# EAGLE design mcu_brd3 (EAGLE 7.7.0)
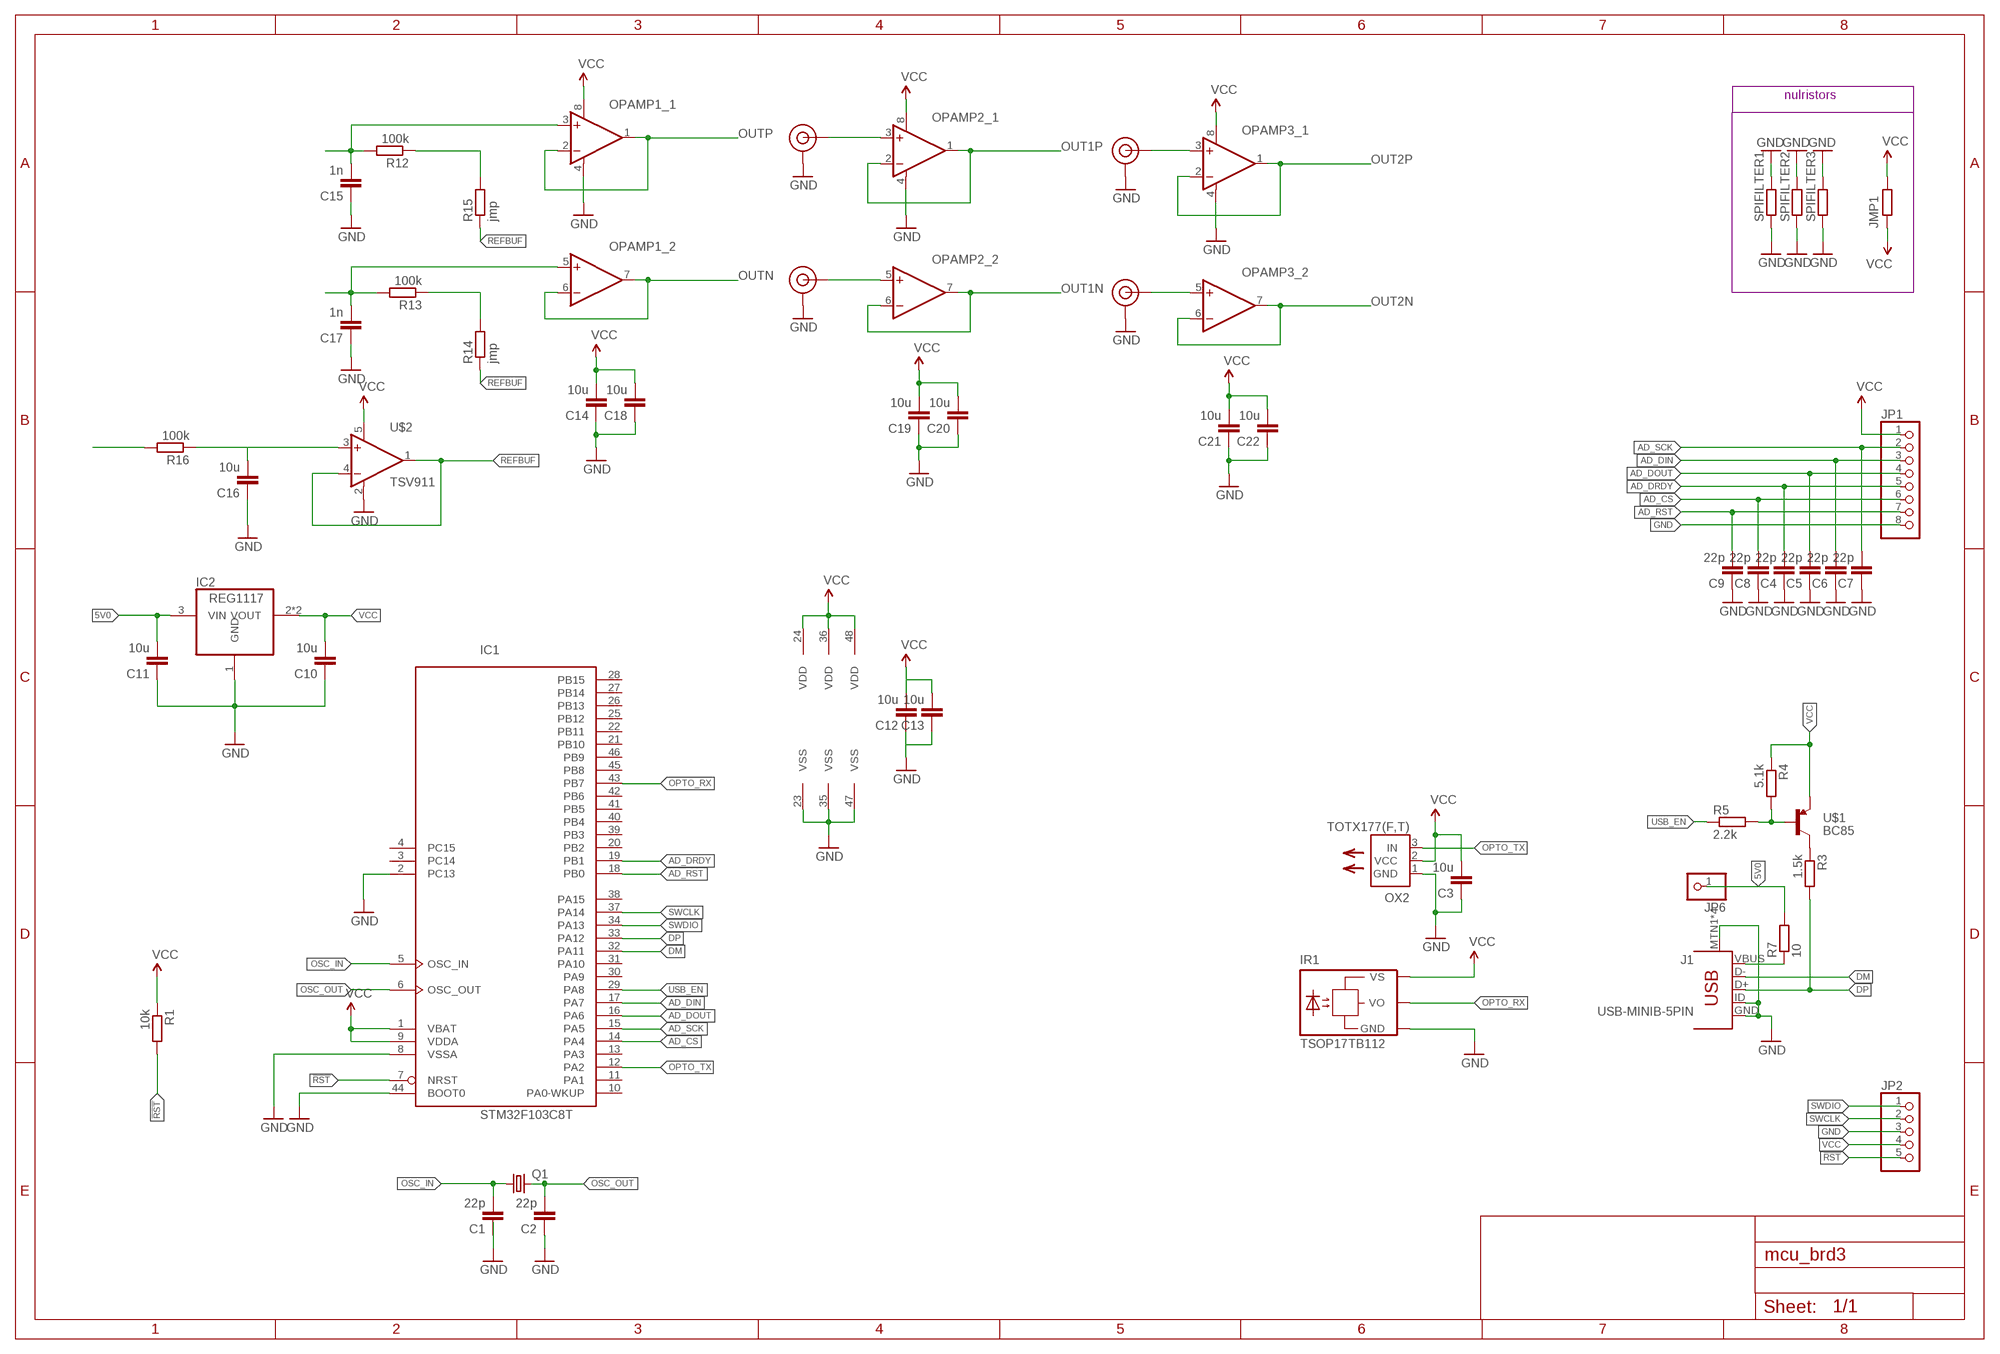
[diagram p0: schematic, sheet 1]

## Parts
C1  22p  CC0603  [C0603]
C2  22p  CC0603  [C0603]
C3  10u  CC0603  [C0603]
C4  22p  CC0603  [C0603]
C5  22p  CC0603  [C0603]
C6  22p  CC0603  [C0603]
C7  22p  CC0603  [C0603]
C8  22p  CC0603  [C0603]
C9  22p  CC0603  [C0603]
C10  10u  CC0805  [C0805]
C11  10u  CC0805  [C0805]
C12  10u  CC0805  [C0805]
C13  10u  CC0805  [C0805]
C14  10u  CC0805  [C0805]
C15  1n  CC0603  [C0603]
C16  10u  CC0805  [C0805]
C17  1n  CC0603  [C0603]
C18  10u  CC0805  [C0805]
C19  10u  CC0805  [C0805]
C20  10u  CC0805  [C0805]
C21  10u  CC0805  [C0805]
C22  10u  CC0805  [C0805]
IC1  STM32F103C8T  [LQFP48]
IC2  REG1117  [SOT223]
IR1  TSOP17TB112  [1X03]
J1  USB-MINIB-5PIN  [USB-MINIB]
J$1  SMA_EDGE  [SMA-EDGE]
J$2  SMA_EDGE  [SMA-EDGE]
J$3  SMA_EDGE  [SMA-EDGE]
J$4  SMA_EDGE  [SMA-EDGE]
JMP1  R0603  [0603]
JP1  PINHD-1X8  [1X08]
JP2  PINHD-1X5  [1X05]
JP6  PINHD-1X1  [1X01]
OPAMP1  LMC662  [SO08]
OPAMP2  LMC662  [SO08]
OPAMP3  LMC662  [SO08]
OX2  TOTX177(F,T)  [TOTX]
Q1  CRYSTALHC49UP  [HC49UP]
R1  10k  R0603  [0603]
R3  1.5k  R0603  [0603]
R4  5.1k  R0603  [0603]
R5  2.2k  R0603  [0603]
R7  10  R0805  [R0805]
R12  100k  R0603  [0603]
R13  100k  R0603  [0603]
R14  jmp  R0603  [0603]
R15  jmp  R0603  [0603]
R16  100k  R0603  [0603]
SPIFILTER1  R0603  [0603]
SPIFILTER2  R0603  [0603]
SPIFILTER3  R0603  [0603]
U$1  BC85  [SOT23]
U$2  TSV911  [SOT23-5L]

## Nets
5V0: C11.2 IC2.3(VIN) JP6.1 R7.2
!RST: IC1.7(NRST) JP2.5 R1.2
AD_CS: C8.2 IC1.14(PA4) JP1.6
AD_DIN: C6.2 IC1.17(PA7) JP1.3
AD_DOUT: C5.2 IC1.16(PA6) JP1.4
AD_DRDY: C4.2 IC1.19(PB1) JP1.5
AD_RST: C9.2 IC1.18(PB0) JP1.7
AD_SCK: C7.2 IC1.15(PA5) JP1.2
DM: IC1.32(PA11) J1.D-
DP: IC1.33(PA12) J1.D+ R3.2
GND: C1.1 C2.1 C3.1 C4.1 C5.1 C6.1 C7.1 C8.1 C9.1 C10.1 C11.1 C12.1 C13.1 C14.1 C15.1 C16.1 C17.1 C18.1 C19.1 C20.1 C21.1 C22.1 IC1.2(PC13) IC1.8(VSSA) IC1.23(VSS) IC1.35(VSS) IC1.44(BOOT0) IC1.47(VSS) IC2.1(GND) IR1.3(GND) J1.GND J1.ID J1.MTN1 J1.MTN2(MTN1) J1.MTN3(MTN1) J1.MTN4(MTN1) J$1.GND@0(GND) J$1.GND@1(GND) J$1.GND@2(GND) J$1.GND@3(GND) J$2.GND@0(GND) J$2.GND@1(GND) J$2.GND@2(GND) J$2.GND@3(GND) J$3.GND@0(GND) J$3.GND@1(GND) J$3.GND@2(GND) J$3.GND@3(GND) J$4.GND@0(GND) J$4.GND@1(GND) J$4.GND@2(GND) J$4.GND@3(GND) JP1.8 JP2.3 OPAMP1.4(_1:V-) OPAMP2.4(_1:V-) OPAMP3.4(_1:V-) OX2.1(GND) SPIFILTER1.1 SPIFILTER1.2 SPIFILTER2.1 SPIFILTER2.2 SPIFILTER3.1 SPIFILTER3.2 U$2.2(V-)
N$1: J$2.SIG(SIGNAL) OPAMP2.5(_2:+IN)
N$2: J$1.SIG(SIGNAL) OPAMP2.3(_1:+IN)
N$3: R3.1 U$1.3(C)
N$4: R4.2 R5.2 U$1.1(B)
N$5: J$4.SIG(SIGNAL) OPAMP3.5(_2:+IN)
N$6: C17.2 OPAMP1.5(_2:+IN) R13.2
N$7: J$3.SIG(SIGNAL) OPAMP3.3(_1:+IN)
N$8: R12.1 R15.2
N$10: C15.2 OPAMP1.3(_1:+IN) R12.2
N$17: R16.2
N$18: R13.1 R14.2
N$19: C16.2 R16.1 U$2.3(+IN)
OPTO_RX: IC1.43(PB7) IR1.1(VO)
OPTO_TX: IC1.12(PA2) OX2.3(IN)
OSC_IN: C1.2 IC1.5(OSC_IN) Q1.1
OSC_OUT: C2.2 IC1.6(OSC_OUT) Q1.2
OUT1N: OPAMP2.6(_2:-IN) OPAMP2.7(_2:OUT)
OUT1P: OPAMP2.1(_1:OUT) OPAMP2.2(_1:-IN)
OUT2N: OPAMP3.6(_2:-IN) OPAMP3.7(_2:OUT)
OUT2P: OPAMP3.1(_1:OUT) OPAMP3.2(_1:-IN)
OUTN: OPAMP1.6(_2:-IN) OPAMP1.7(_2:OUT)
OUTP: OPAMP1.1(_1:OUT) OPAMP1.2(_1:-IN)
REFBUF: R14.1 R15.1 U$2.1(OUT) U$2.4(-IN)
SWCLK: IC1.37(PA14) JP2.2
SWDIO: IC1.34(PA13) JP2.1
USB_EN: IC1.29(PA8) R5.1
VBUS: J1.VBUS R7.1
VCC: C3.2 C10.2 C12.2 C13.2 C14.2 C18.2 C19.2 C20.2 C21.2 C22.2 IC1.1(VBAT) IC1.9(VDDA) IC1.24(VDD) IC1.36(VDD) IC1.48(VDD) IC2.2(VOUT) IC2.4(VOUT) IR1.2(VS) JMP1.1 JMP1.2 JP1.1 JP2.4 OPAMP1.8(_1:V+) OPAMP2.8(_1:V+) OPAMP3.8(_1:V+) OX2.2(VCC) R1.1 R4.1 U$1.2(E) U$2.5(V+)
Unconnected: IC1.3(PC14) IC1.4(PC15) IC1.10(PA0-WKUP) IC1.11(PA1) IC1.13(PA3) IC1.20(PB2) IC1.21(PB10) IC1.22(PB11) IC1.25(PB12) IC1.26(PB13) IC1.27(PB14) IC1.28(PB15) IC1.30(PA9) IC1.31(PA10) IC1.38(PA15) IC1.39(PB3) IC1.40(PB4) IC1.41(PB5) IC1.42(PB6) IC1.45(PB8) IC1.46(PB9)

## Notes on the sheet
- nulristors

## Library data of the parts
C1-C22 = smalsmd:C: Capacitor
IC1 = micro-stm_v3:STM32F103C*T: ARM 32-bit Cortex™-M3 CPU 72 MHz maximum frequency 16 to 128 Kbytes of Flash memory 6 to 20 kbytes of SRAM 37 GPIOs 2.0 to 3.6 V application supply
IC2 = burr-brown:REG1117: 800mA and 1A Low Dropout (LDO) Positive Regulator 1.8V, 2.5V, 2.85V, 3.3V, 5V, and Adj; MPN: REG1117; OC_FARNELL: 1097566; OC_NEWARK: 14P6981
IR1 = telefunken:TSOP17*TB1: TSOP17..TB1 IR Receiver Modules for Remote Control Systems Source: http://www.vishay.com/docs/82042/82042.pdf
J1 = SparkFun-Connectors:USB-MINIB: Mini-USB "B" connector with 5th pin broken out. Created new symbol breaking out 5th "ID" pin in mini/micro USB connector spec. See: http://en.wikipedia.org/wiki/Mini_usb#Cables. Uses same footprint as 4-pin symbol. Also added pins to connect to mounting / shield pads if required (probably not generally needed as signals aren't shielded once they leave the connector).; PROD_ID: CONN-08193
J$1-J$4 = SparkFun-Connectors:SMA_EDGE: SMA Antenna Connector End launch SMA connector. The paste layer has been removed so that the connector can be hand soldered onto the board after reflow.
JMP1 R1 R3-R5 R7 R12-R16 SPIFILTER1-SPIFILTER3 = smalsmd:R
JP1 = pinhead:PINHD-1X8: PIN HEADER
JP2 = pinhead:PINHD-1X5: PIN HEADER
JP6 = pinhead:PINHD-1X1: PIN HEADER
OPAMP1-OPAMP3 = OU:LMC662
OX2 = toslink:TOTX177(F,T): FIBER OPTIC TRANSMITTING MODULE
Q1 = crystal:CRYSTAL: CRYSTAL; OC_FARNELL: unknown; OC_NEWARK: unknown
U$1 = smalsmd:BC85*
U$2 = OU:TSV911

## Board
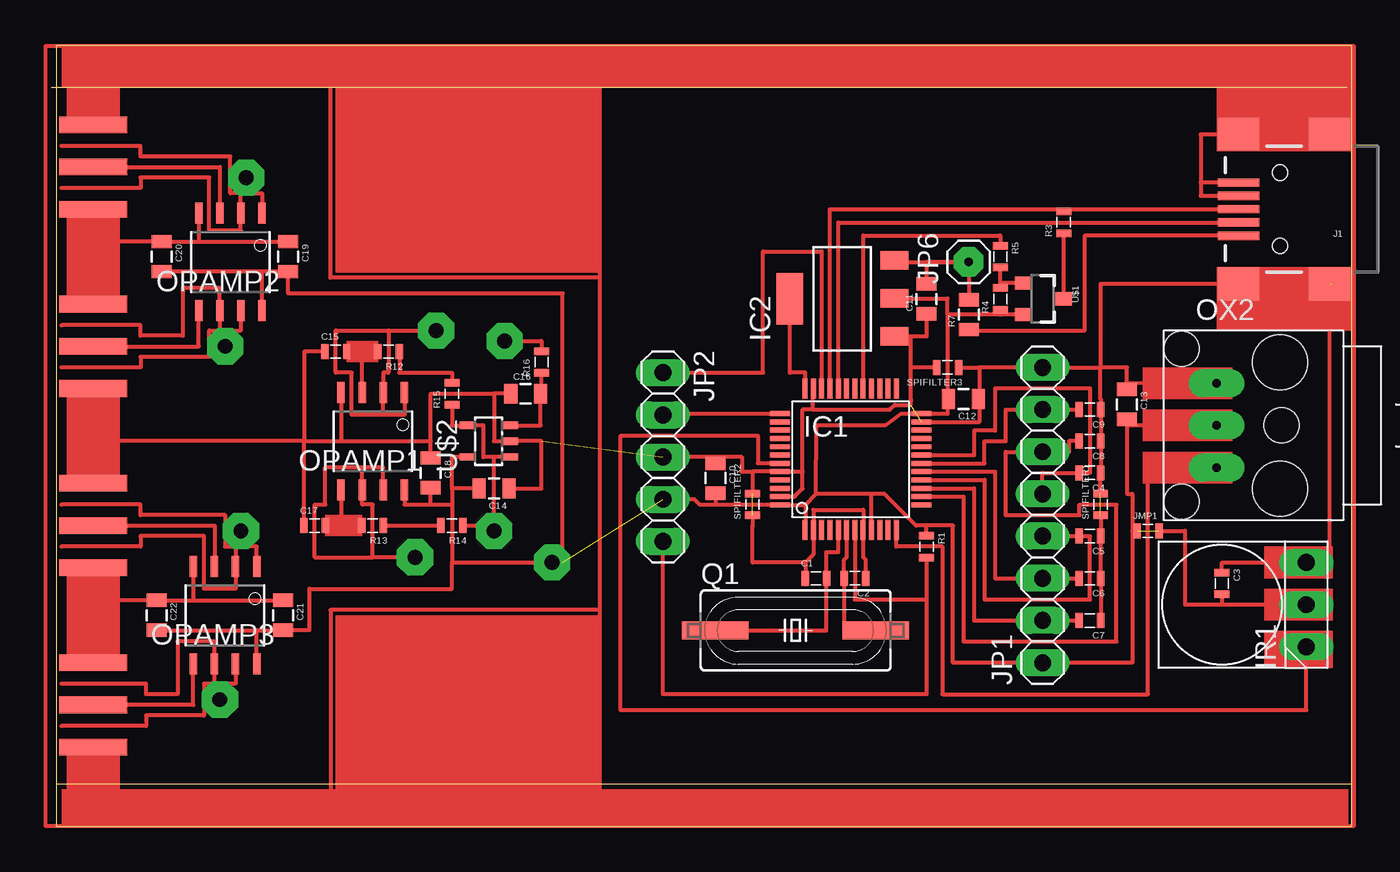
[diagram p1: board, top side]
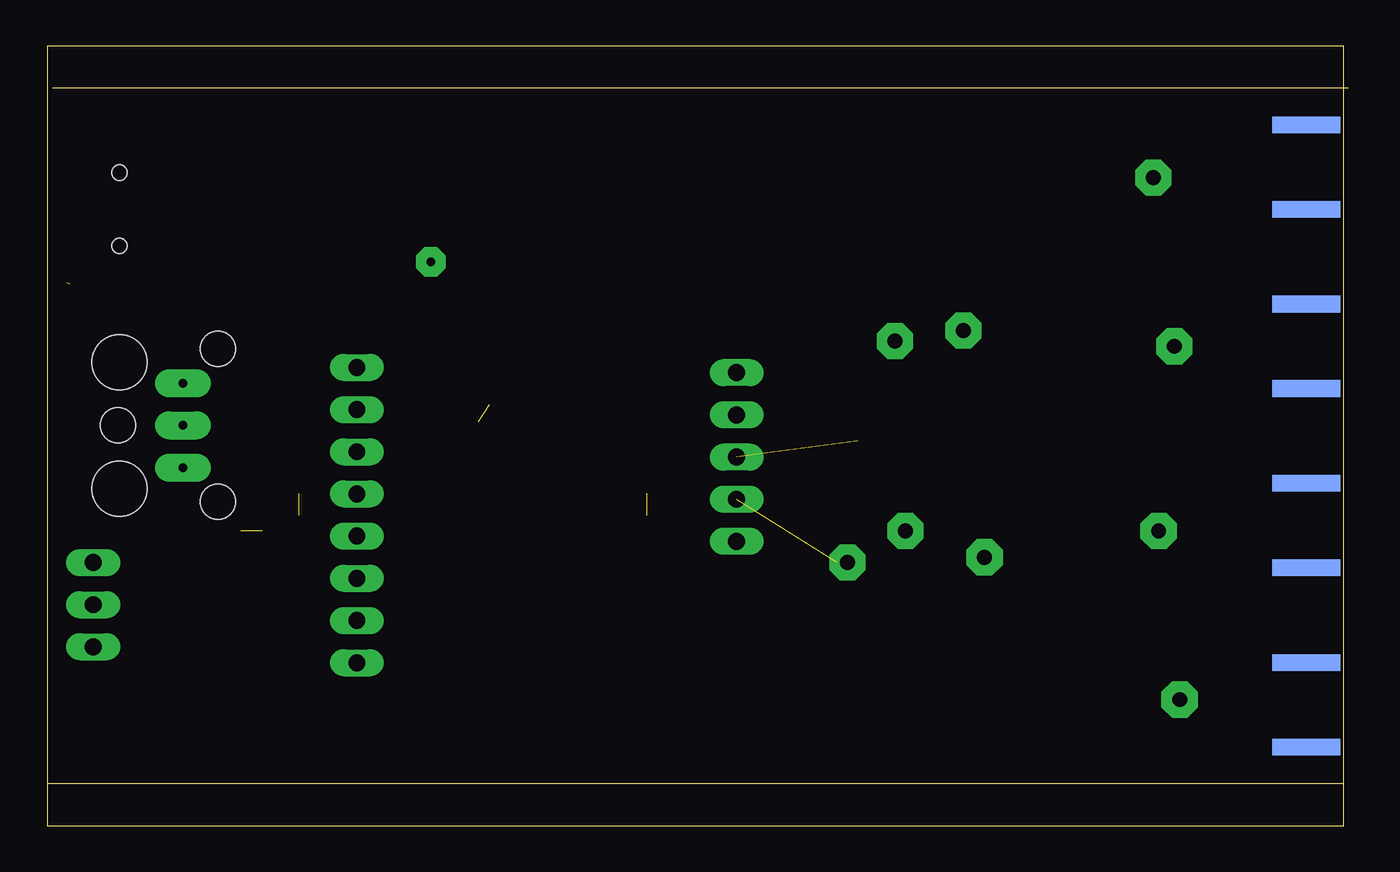
[diagram p2: board, bottom side, seen from below]

Size 78.32 x 47 mm. Coordinates in mm from the lower left corner, seen from the top.
Outline: 78.32,2.54 78.32,0 0.32,0 0.32,2.54
Outline: 78.32,2.54 78.32,47 0.32,47 0.32,2.54
Outline: 0.32,2.54 78.32,2.54
Outline: 78,44.46 0,44.46
Copper layers (1*16): Top 0.035mm / dielectric 1.5mm / Bottom 0.035mm
Design rules "SparkFun *": minimum track width 0.2mm, minimum drill 0.4mm, track to track 0.2mm, track to pad 0.2mm, pad to pad 0.2mm, via to via 0.2mm, smd to smd 0.2mm, copper to edge 0.999mm, drill to drill 0.999mm, minimum pad ring 12mil, minimum via ring 10mil, stop-mask expansion 4mil, vias tented up to drill 25mil, thermal gap 10mil

### Footprints (pad centres in the part's own frame; a part is rotated, then mirrored left to right if it is on the bottom)
C0603 = smd 0.45 x 0.9: 1 -0.65,0; 2 0.65,0
C0805 = smd 0.8 x 1.2: 1 -0.9,0; 2 0.9,0
LQFP48 = smd 0.3 x 1.2: 1 -2.75,-4.25; 2 -2.25,-4.25; 3 -1.75,-4.25; 4 -1.25,-4.25; 5 -0.75,-4.25; 6 -0.25,-4.25; 7 0.25,-4.25; 8 0.75,-4.25; 9 1.25,-4.25; 10 1.75,-4.25; 11 2.25,-4.25; 12 2.75,-4.25; 25 2.75,4.25; 26 2.25,4.25; 27 1.75,4.25; 28 1.25,4.25; 29 0.75,4.25; 30 0.25,4.25; 31 -0.25,4.25; 32 -0.75,4.25; 33 -1.25,4.25; 34 -1.75,4.25; 35 -2.25,4.25; 36 -2.75,4.25 | smd 1.2 x 0.3: 13 4.25,-2.75; 14 4.25,-2.25; 15 4.25,-1.75; 16 4.25,-1.25; 17 4.25,-0.75; 18 4.25,-0.25; 19 4.25,0.25; 20 4.25,0.75; 21 4.25,1.25; 22 4.25,1.75; 23 4.25,2.25; 24 4.25,2.75; 37 -4.25,2.75; 38 -4.25,2.25; 39 -4.25,1.75; 40 -4.25,1.25; 41 -4.25,0.75; 42 -4.25,0.25; 43 -4.25,-0.25; 44 -4.25,-0.75; 45 -4.25,-1.25; 46 -4.25,-1.75; 47 -4.25,-2.25; 48 -4.25,-2.75
SOT223 = smd 1.1 x 1.7: 1 -2.261,-3.15; 2 0.025,-3.15; 3 2.311,-3.15 | smd 3.1 x 1.6: 4 0,3.15
1X03 = drill 1.016 long: 1 -2.54,0; 2 0,0; 3 2.54,0
USB-MINIB = smd 2.5 x 0.5: D+ 2.5,0; D- 2.5,0.8; GND 2.5,-1.6; ID 2.5,-0.8; VBUS 2.5,1.6 | smd 2.5 x 2: MTN1 -3,4.5; MTN2 2.5,4.5; MTN3 -3,-4.5; MTN4 2.5,-4.5 | hole 0.9: 0,2.2; 0,-2.2
SMA-EDGE = smd 1 x 4.064: GND@0 0,0; GND@1 5.08,0; SIG 2.54,0 | smd 1 x 4.064 bottom: GND@2 0,0; GND@3 5.08,0
0603 = smd 0.45 x 0.9: 1 -0.65,0; 2 0.65,0
1X08 = drill 1.016 long: 1 -8.89,0; 2 -6.35,0; 3 -3.81,0; 4 -1.27,0; 5 1.27,0; 6 3.81,0; 7 6.35,0; 8 8.89,0
1X05 = drill 1.016 long: 1 -5.08,0; 2 -2.54,0; 3 0,0; 4 2.54,0; 5 5.08,0
1X01 = drill 0.5 pad 1.778 octagon: 1 0,0
SO08 = smd 0.45 x 1.25: 1 -1.905,-2.934; 2 -0.635,-2.934; 3 0.635,-2.934; 4 1.905,-2.934; 5 1.905,2.934; 6 0.635,2.934; 7 -0.635,2.934; 8 -1.905,2.934
TOTX = drill 0.5 pad 1.676 long: 1 -3.81,2.54; 2 -3.81,0; 3 -3.81,-2.54 | hole 3.3: 0,-3.81; 0,3.81 | hole 2.1: 0.09,0; -5.91,4.6; -5.91,-4.6
HC49UP = smd 4 x 1.1: 1 -4.826,0; 2 4.826,0
R0805 = smd 0.8 x 1.2: 1 -0.9,0; 2 0.9,0
SOT23 = smd 0.8 x 1: 1 -0.95,-1.159; 2 0.95,-1.159; 3 0,1.259
SOT23-5L = smd 0.45 x 0.9: 1 -0.95,-1.3; 2 0,-1.3; 3 0.95,-1.3; 4 0.95,1.3; 5 -0.95,1.3

### Placement (x,y rotation side)
C1  46.04,14.92 0 top
C2  48.39,14.92 180 top
C3  70.48,14.61 270 top
C4  62.55,21.27 180 top
C5  62.55,17.46 180 top
C6  62.55,14.92 180 top
C7  62.55,12.38 180 top
C8  62.55,23.18 180 top
C9  62.55,25.08 180 top
C10  40.01,20.95 270 top
C11  52.71,31.75 90 top
C12  54.93,25.72 180 top
C13  64.77,25.4 270 top
C14  26.67,20.32 180 top
C15  17.14,28.57 0 top
C16  28.57,26.04 0 top
C17  15.88,18.1 0 top
C18  22.86,21.27 270 top
C19  14.29,34.29 270 top
C20  6.67,34.29 270 top
C21  13.97,12.7 270 top
C22  6.35,12.7 270 top
IC1  48.14,22.09 0 top
IC2  47.62,31.75 90 top
IR1  75.56,13.34 90 top
J1  73.98,37.15 180 top
J$1  2.54,42.23 270 top
J$2  2.54,31.43 270 top
J$3  2.54,20.64 270 top
J$4  2.54,9.84 270 top
JMP1  66.04,17.78 0 top
JP1  59.69,18.73 90 top
JP2  36.83,22.23 270 top
JP6  55.25,33.97 90 top
OPAMP1  19.37,23.18 180 top
OPAMP2  10.79,33.97 180 top
OPAMP3  10.48,12.7 180 top
OX2  73.98,24.13 0 top
Q1  44.83,11.79 0 top
R1  52.71,16.83 270 top
R3  60.96,36.36 90 top
R4  57.15,31.75 90 top
R5  57.15,34.29 270 top
R7  55.25,30.8 90 top
R12  20.32,28.57 180 top
R13  19.37,18.1 180 top
R14  24.13,18.1 180 top
R15  24.13,26.04 90 top
R16  29.53,27.94 90 top
SPIFILTER1  63.18,19.37 90 top
SPIFILTER2  42.23,19.37 90 top
SPIFILTER3  53.98,27.62 180 top
U$1  59.69,31.75 270 top
U$2  26.35,23.18 90 top

### Tracks (layer width: path | path; a pad name or v marks a point on that pad's centre or on a via)
5V0
  Top 0.2: IC2.3 50.14,33.97
  Top 0.254: 50.14,33.97 JP6.1 | JP6.1 52.71,33.97 C11.2 | JP6.1 R7.2
!RST
  Top 0.254: IC1.7 48.39,13.65 52.71,13.65 | 52.71,13.65 52.71,7.94 36.83,7.94 JP2.5 | R1.2 52.71,13.65
AD_CS
  Top 0.254: IC1.14 54.93,19.84 54.93,11.11 64.14,11.11 64.14,19.37 61.91,19.37 61.91,18.73 57.47,18.73 57.47,22.54 JP1.6 61.28,22.54 61.28,23.18 C8.2
AD_DIN
  Top 0.254: IC1.17 56.83,21.34 56.83,14.92 JP1.3 C6.2
AD_DOUT
  Top 0.254: IC1.16 56.2,20.84 56.2,13.65 62.55,13.65 62.55,17.46 C5.2 JP1.4
AD_DRDY
  Top 0.254: IC1.19 55.56,22.34 55.56,23.81 56.83,23.81 56.83,26.35 62.55,26.35 62.55,21.27 C4.2 59.69,21.27 JP1.5
AD_RST
  Top 0.254: IC1.18 56.2,21.84 56.2,23.18 57.47,23.18 57.47,25.08 JP1.7 C9.2
AD_SCK
  Top 0.254: IC1.15 55.56,20.34 55.56,12.38 JP1.2 C7.2
DM
  Top 0.254: IC1.32 47.39,36.35 J1.D-
DP
  Top 0.254: IC1.33 46.89,37.15 60.96,37.15 | 60.96,37.15 J1.D+ | R3.2 60.96,37.15
GND  (5 unrouted)
  Top 0.2: 76.98,41.59 J1.MTN3 | OX2.1 64.77,26.67 | 42.23,18.1
  Top 0.254: C5.1 C6.1 C7.1 63.18,12.38 | C5.1 63.2,17.78 63.18,17.78 63.18,17.46 C5.1 | 45.88,25.08 IC1.35 45.88,26.36 | SPIFILTER1.2 63.18,21.26 C4.1 C8.1 C9.1 63.2,25.72 63.18,25.72 63.18,27.62 | SPIFILTER1.1 C5.1 | 45.24,21.34 45.24,20.32 44.77,19.84 IC1.47 | 45.24,21.34 45.24,25.08 45.88,25.08 | OPAMP1.4 17.46,23.18 | 17.46,23.18 22.86,23.18 | 26.67,26.04 26.67,23.18 U$2.2 29.53,23.18 29.53,20.32 C14.1 | C16.1 26.67,26.04 | C17.1 15.24,23.18 | 15.24,23.18 17.46,23.18 | 45.24,21.34 IC1.44 42.23,21.34 | 63.18,27.62 JP1.8 55.88,27.62 | J1.GND 69.21,38.75 | 69.21,38.75 69.21,37.95 J1.ID | J1.MTN4 69.21,41.65 69.21,38.75 | 51.75,27.62 51.75,25.72 51.75,25.36 50.8,25.36 50.48,25.08 45.88,25.08 | 51.75,27.62 51.75,29.49 | C11.1 52.71,29.49 51.75,29.49 | 51.75,29.49 IC2.1 | SPIFILTER2.1 42.23,18.1 42.23,15.88 45.4,15.88 | 55.88,27.62 55.88,25.72 | 55.88,25.72 55.88,24.34 IC1.23 | 63.18,27.62 64.77,27.62 64.77,26.67 C13.1 | C3.1 70.49,15.88 IR1.3 76.98,15.88 J1.MTN1 63.18,32.65 63.18,27.62 | 42.23,21.34 SPIFILTER2.2 42.23,20 | 8.89,35.19 C20.1 2.54,35.19 | 8.89,35.19 C19.1 | OPAMP2.4 8.89,35.19 | 8.57,13.6 C22.1 2.54,13.6 | 8.57,13.6 C21.1 | OPAMP3.4 8.57,13.6 | J$1.GND@1 2.54,35.19 | 2.54,35.19 J$2.GND@0 | J$2.GND@1 2.54,23.18 | 2.54,23.18 J$3.GND@0 | J$3.GND@1 2.54,13.6 | 2.54,13.6 J$4.GND@0 | C15.1 15.24,28.57 15.24,23.18 | 22.86,23.18 22.86,26.04 26.67,26.04 | 15.24,23.18 2.54,23.18 | C18.1 22.86,23.18 | SPIFILTER3.2 51.75,27.62 | SPIFILTER3.1 55.88,27.62 | C12.1 55.88,25.72 | 40.01,22.23 41.59,22.23 41.59,21.34 42.23,21.34 | 40.01,22.23 JP2.3 | C10.1 40.01,22.23 | C2.1 49.04,16.05 48.89,16.2 IC1.8 48.9,19.05 45.89,19.05 IC1.2 45.89,16.36 45.4,15.88
  Top 0.254: 45.4,15.88 45.4,14.94 C1.1
  Top 0.61: 77.15,32.7 76.02,32.7
N$1
  Top 0.254: OPAMP2.5 8.89,28.89 J$2.SIG
N$2
  Top 0.254: OPAMP2.3 10.16,39.69 J$1.SIG
N$3
  Top 0.254: U$1.3 60.96,32.07 R3.1
N$4
  Top 0.254: U$1.1 57.15,32.7 | 57.15,32.7 R5.2 | R4.2 57.15,32.7
N$5
  Top 0.254: OPAMP3.5 8.57,7.3 J$4.SIG
N$6
  Top 0.254: OPAMP1.5 17.46,18.1 | 17.46,18.1 R13.2 | C17.2 17.46,18.1
N$7
  Top 0.254: OPAMP3.3 9.84,18.1 J$3.SIG
N$8
  Top 0.254: R12.1 20.97,27.3 24.13,27.3 R15.2
N$9  (via drill 0.6)
  other vias: 73.98,20.32
N$10
  Top 0.254: OPAMP1.3 18.73,28.57 | R12.2 18.73,28.57 | 18.73,28.57 C15.2
N$11  (via drill 0.6)
  other vias: 73.98,27.94
N$12
  Top 0.254: 78.42,46.99 78.42,0 -0.32,0 -0.32,46.99 78.42,46.99
N$13
  Top 0.254: 32.07,46.67 33.02,46.67 33.02,33.02 | 33.02,33.02 33.02,13.02 | 33.02,13.02 33.02,0 | 33.02,33.02 16.83,33.02 16.83,46.04 | 33.02,13.02 16.83,13.02 16.83,0.95
N$17  (via drill 0.9 pad 2.18)
  Top 0.254: v27.31,29.21 29.53,29.21 R16.2
N$18
  Top 0.254: R13.1 R14.2
N$19
  Top 0.254: R16.1 29.53,26.04 C16.2 29.47,24.13 U$2.3
OPTO_RX
  Top 0.254: IC1.43 42.54,21.84 42.54,23.5 34.29,23.5 34.29,6.99 75.57,6.99 IR1.1
OPTO_TX
  Top 0.2: 66.04,21.59 OX2.3
  Top 0.254: IC1.12 50.89,16.83 53.66,16.83 53.66,7.94 66.04,7.94 66.04,21.59
OSC_IN
  Top 0.254: Q1.1 46.67,11.79 46.67,14.61 | C1.2 46.67,14.61 | 46.67,14.61 46.67,16.51 47.39,16.51 IC1.5
OSC_OUT
  Top 0.254: Q1.2 47.74,11.79 C2.2 47.74,16.04 47.89,16.18 IC1.6
OUT1N  (via drill 0.9 pad 2.18)
  Top 0.254: 10.16,29.84 OPAMP2.6 10.16,32.38 7.94,32.38 7.94,29.53 5.4,29.53 5.4,30.16 0.64,30.16 | OPAMP2.7 11.43,29.84 10.16,29.84 | 10.16,29.84 9.52,29.84 9.52,29.21 9.52,28.89 | 9.52,28.89 9.52,28.26 5.4,28.26 5.4,27.62 0.64,27.62 | v10.48,28.89 9.52,28.89
OUT1P  (via drill 0.9 pad 2.18)
  Top 0.254: 11.43,38.1 10.79,38.1 10.79,39.05 | 10.79,39.05 10.79,40.32 5.4,40.32 5.4,40.96 0.64,40.96 | 11.43,38.1 OPAMP2.2 11.43,35.88 9.52,35.88 9.52,39.05 5.4,39.05 5.4,38.42 0.64,38.42 | 11.43,38.1 12.7,38.1 OPAMP2.1 | v11.75,39.05 10.79,39.05
OUT2N  (via drill 0.9 pad 2.18)
  Top 0.254: 9.21,7.62 9.21,8.57 9.84,8.57 | 9.21,7.62 9.21,6.67 5.71,6.67 5.71,6.03 0.64,6.03 | OPAMP3.7 11.11,8.57 9.84,8.57 | 9.84,8.57 OPAMP3.6 9.84,11.11 7.62,11.11 7.62,7.94 5.71,7.94 5.71,8.57 0.64,8.57 | v10.16,7.62 9.21,7.62
OUT2P  (via drill 0.9 pad 2.18)
  Top 0.254: OPAMP3.1 12.38,16.83 11.11,16.83 | 10.48,17.78 10.48,18.73 5.4,18.73 5.4,19.37 0.64,19.37 | 10.48,17.78 10.48,16.83 11.11,16.83 | 11.11,16.83 OPAMP3.2 11.11,14.29 9.21,14.29 9.21,17.46 5.4,17.46 5.4,16.83 0.64,16.83 | v11.43,17.78 10.48,17.78
OUTN  (via drill 0.9 pad 2.18)
  Top 0.254: 18.73,21.59 16.51,21.59 16.51,19.37 15.87,19.37 15.87,16.19 19.37,16.19 | 18.73,21.59 OPAMP1.6 18.73,19.37 19.37,19.37 19.37,16.19 | OPAMP1.7 20,21.59 18.73,21.59 | v21.91,16.19 19.37,16.19
OUTP  (via drill 0.9 pad 2.18)
  Top 0.254: 20,24.77 18.1,24.77 18.1,27.3 17.15,27.3 17.15,29.84 20.32,29.84 | 20.32,29.84 20.32,27.3 20,27.3 OPAMP1.2 20,24.77 | OPAMP1.1 21.27,24.77 20,24.77 | 20.32,29.84 v23.18,29.84
REFBUF  (via drill 0.9 pad 2.18)
  Top 0.254: U$2.1 26.67,22.23 | U$2.4 26.04,24.13 26.04,22.23 26.67,22.23 | 24.77,24.13 U$2.4 | U$2.4 24.13,24.13 R15.1 | R14.1 26.67,18.1 | 26.67,18.1 26.67,22.23 | v26.67,17.78 26.67,18.1
SWCLK
  Top 0.254: JP2.2 38.18,24.84 IC1.37
SWDIO
  Top 0.254: IC1.34 46.39,34.61 42.86,34.61 42.86,27.3 JP2.1
USB_EN
  Top 0.254: IC1.29 48.9,35.56 57.15,35.56 R5.1
VBUS
  Top 0.2: J1.VBUS | 62.23,35.55 62.23,35.56
  Top 0.254: J1.VBUS 62.23,35.55 62.23,29.84 55.25,29.84 R7.1
VCC  (via drill 0.9 pad 2.18)  (2 unrouted)
  Top 0.2: JMP1.1 65.09,17.78
  Top 0.254: 49.37,20 49.37,17.86 IC1.9 | 45.4,19.33 46.04,20 | 45.4,19.33 45.4,17.86 IC1.1 | 45.4,19.33 45.39,19.34 IC1.48 40.01,19.34 | IC1.36 45.4,26.36 45.4,27.3 44.48,27.3 IC2.4 | 52.71,18.1 54.29,18.1 54.29,9.84 JP1.1 65.09,9.84 65.09,17.78 65.09,20 64.77,20 64.77,24.13 | 52.71,18.1 52.07,18.1 50.16,20 49.37,20 | 49.37,20 46.04,20 | 46.04,20 46.03,20 46.04,24.13 50.21,24.13 51.17,24.84 IC1.24 53.97,24.84 53.97,25.72 | 57.15,30.8 U$1.2 | 57.15,30.8 53.97,30.8 | IC2.2 53.97,31.77 53.97,30.8 | 53.97,30.8 53.97,25.72 | IR1.2 70.49,13.34 | 70.49,13.34 68.26,13.34 68.26,17.78 JMP1.2 | C3.2 70.49,13.34 | R1.1 52.71,18.1 | 12.7,33.39 C19.2 14.29,32.07 30.8,32.07 30.8,15.88 v30.16,15.88 24.13,15.88 | 12.7,33.39 C20.2 | OPAMP2.8 12.7,33.39 | C22.2 12.38,11.8 | 12.38,11.8 C21.2 15.56,11.8 15.56,14.29 24.13,14.29 24.13,15.88 | OPAMP3.8 12.38,11.8 | U$2.5 25.08,22.23 24.13,22.23 24.13,20.32 | C14.2 24.13,20.32 | OPAMP1.8 21.27,19.37 22.86,19.37 | 22.86,19.37 C18.2 | 24.13,20.32 24.13,19.37 | 22.86,19.37 24.13,19.37 | 24.13,19.37 24.13,15.88 | JMP1.1 65.41,17.78 | C12.2 53.97,25.72 | 40.01,19.34 39.08,19.34 38.73,19.68 JP2.4 | C10.2 40.01,19.34 | R4.1 57.15,30.8 | OX2.2 64.77,24.13 | 64.77,24.13 C13.2
(copper drawn outside any net)
  shapes: Top area x19